# EAGLE schematic mjoy (EAGLE 5.10)
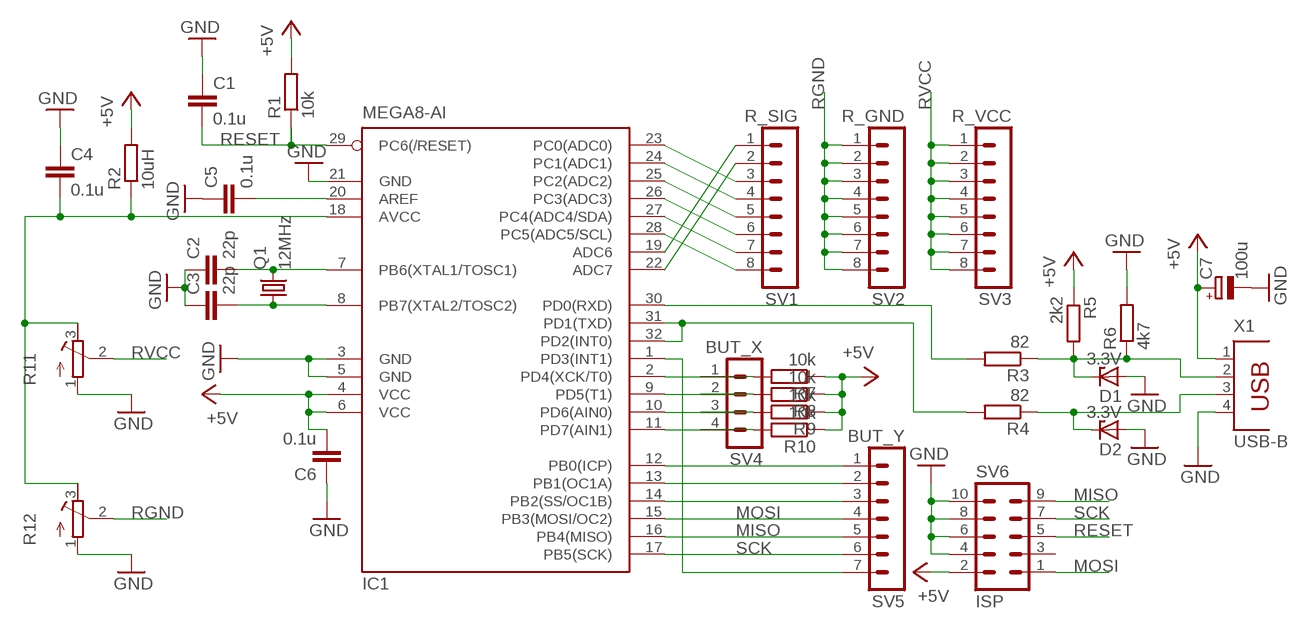
[diagram p0: schematic, sheet 1]

## Parts
C1  0.1u  C-EUC0805  [C0805]
C2  22p  C-EUC0805  [C0805]
C3  22p  C-EUC0805  [C0805]
C4  0.1u  C-EUC0805  [C0805]
C5  0.1u  C-EUC0805  [C0805]
C6  0.1u  C-EUC0805  [C0805]
C7  100u  CPOL-EUE  [PANASONIC_E]
D1  3.3V  ZENER-DIODESOD80C  [SOD80C]
D2  3.3V  ZENER-DIODESOD80C  [SOD80C]
IC1  MEGA8-AI  [TQFP32-08]
Q1  12MHz  CRYSTALHC49UP  [HC49UP]
R1  10k  R-EU_R0805  [R0805]
R2  10uH  R-EU_R1210  [R1210]
R3  82  R-EU_R0805  [R0805]
R4  82  R-EU_R0805  [R0805]
R5  2k2  R-EU_R0805  [R0805]
R6  4k7  R-EU_R0805  [R0805]
R7  10k  R-EU_R0805  [R0805]
R8  10k  R-EU_R0805  [R0805]
R9  10k  R-EU_R0805  [R0805]
R10  10k  R-EU_R0805  [R0805]
R11  R-TRIMM3296Y  [RTRIM3296Y]
R12  R-TRIMM3296Y  [RTRIM3296Y]
SV1  R_SIG  MA08-1  [MA08-1]
SV2  R_GND  MA08-1  [MA08-1]
SV3  R_VCC  MA08-1  [MA08-1]
SV4  BUT_X  MA04-1  [MA04-1]
SV5  BUT_Y  MA07-1  [MA07-1]
SV6  ISP  MA05-2  [MA05-2]
X1  USB-B  PN61729  [PN61729]

## Nets
+5V: C6.2 C7.+ IC1.4(VCC) IC1.6(VCC) R1.2 R2.2 R5.1 R7.1 R8.1 R9.1 R10.1 SV6.2 X1.1
AREF: C5.2 IC1.20(AREF)
GND: C1.1 C2.1 C3.1 C4.1 C5.1 C6.1 C7.- D1.A D2.A IC1.3(GND) IC1.5(GND) IC1.21(GND) R6.2 R11.1(E) R12.1(E) SV6.4 SV6.6 SV6.8 SV6.10 X1.4
MISO: IC1.16(PB4(MISO)) SV5.5 SV6.9
MOSI: IC1.15(PB3(MOSI/OC2)) SV5.4 SV6.1
N$2: C4.2 IC1.18(AVCC) R2.1 R11.3(A) R12.3(A)
N$3: IC1.19(ADC6) SV1.1
N$4: C3.2 IC1.8(PB7(XTAL2/TOSC2)) Q1.1
N$5: C2.2 IC1.7(PB6(XTAL1/TOSC1)) Q1.2
N$6: IC1.22(ADC7) SV1.2
N$7: IC1.23(PC0(ADC0)) SV1.3
N$8: IC1.24(PC1(ADC1)) SV1.4
N$9: IC1.25(PC2(ADC2)) SV1.5
N$10: IC1.26(PC3(ADC3)) SV1.6
N$11: IC1.27(PC4(ADC4/SDA)) SV1.7
N$12: IC1.28(PC5(ADC5/SCL)) SV1.8
N$15: IC1.30(PD0(RXD)) R3.2
N$16: IC1.31(PD1(TXD)) IC1.32(PD2(INT0)) R4.2
N$17: D1.C R3.1 R5.2 R6.1 X1.2
N$18: D2.C R4.1 X1.3
N$21: IC1.2(PD4(XCK/T0)) R7.2 SV4.1
N$22: IC1.9(PD5(T1)) R8.2 SV4.2
N$23: IC1.10(PD6(AIN0)) R9.2 SV4.3
N$24: IC1.11(PD7(AIN1)) R10.2 SV4.4
N$25: IC1.12(PB0(ICP)) SV5.1
N$26: IC1.13(PB1(OC1A)) SV5.2
N$27: IC1.14(PB2(SS/OC1B)) SV5.3
N$31: IC1.1(PD3(INT1)) SV5.7
RESET: C1.2 IC1.29(PC6(/RESET)) R1.1 SV6.5
RGND: R12.2(S) SV2.1 SV2.2 SV2.3 SV2.4 SV2.5 SV2.6 SV2.7 SV2.8
RVCC: R11.2(S) SV3.1 SV3.2 SV3.3 SV3.4 SV3.5 SV3.6 SV3.7 SV3.8
SCK: IC1.17(PB5(SCK)) SV5.6 SV6.7
Unconnected: SV6.3

## Library data of the parts
C1-C6 = rcl:C-EU: CAPACITOR, European symbol
C7 = rcl:CPOL-EU: POLARIZED CAPACITOR, European symbol
D1 D2 = diode:ZENER-DIODE: Z-Diode
IC1 = atmel:MEGA8: MICROCONTROLLER 8 Kbytes FLASH, 1 kbytes SRAM, 512 bytes EEPROM, USART, 6-channel 10 bit ADC, 2-channel 8 bit ADC Pin compatible with Atmega48, ATMega88, ATMega168 Source: avr.lbr
Q1 = crystal:CRYSTAL: CRYSTAL
R1-R10 = rcl:R-EU_: RESISTOR, European symbol
R11 R12 = rcl:R-TRIMM: Trimm resistor
SV1-SV3 = con-lstb:MA08-1: PIN HEADER
SV4 = con-lstb:MA04-1: PIN HEADER
SV5 = con-lstb:MA07-1: PIN HEADER
SV6 = con-lstb:MA05-2: PIN HEADER
X1 = con-berg:PN61729: BERG USB connector